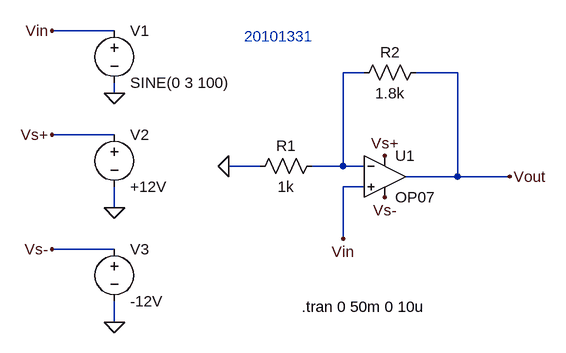
[diagram p0: schematic Non-Inverting Amplifier.asc]
Non-Inverting Amplifier.asc, the LTspice schematic file:
Version 4
SHEET 1 880 680
WIRE 32 -64 -64 -64
WIRE 416 0 384 0
WIRE 560 0 496 0
WIRE 32 32 32 16
WIRE 32 96 -64 96
WIRE 256 144 208 144
WIRE 384 144 384 0
WIRE 384 144 336 144
WIRE 416 144 384 144
WIRE 560 160 560 0
WIRE 560 160 480 160
WIRE 640 160 560 160
WIRE 416 176 384 176
WIRE 32 208 32 176
WIRE 384 256 384 176
WIRE 32 272 -64 272
WIRE 32 384 32 352
FLAG 32 32 0
FLAG 32 208 0
FLAG 32 384 0
FLAG 448 128 Vs+
FLAG 448 192 Vs-
FLAG 208 144 0
FLAG -64 96 Vs+
FLAG -64 272 Vs-
FLAG -64 -64 Vin
FLAG 384 256 Vin
FLAG 640 160 Vout
SYMBOL OpAmps\\OP07 448 96 R0
SYMATTR InstName U1
SYMBOL voltage 32 -80 R0
WINDOW 123 0 0 Left 0
WINDOW 39 0 0 Left 0
SYMATTR InstName V1
SYMATTR Value SINE(0 3 100)
SYMBOL voltage 32 80 R0
WINDOW 123 0 0 Left 0
WINDOW 39 0 0 Left 0
SYMATTR InstName V2
SYMATTR Value +12V
SYMBOL voltage 32 256 R0
WINDOW 123 0 0 Left 0
WINDOW 39 0 0 Left 0
SYMATTR InstName V3
SYMATTR Value -12V
SYMBOL res 352 128 R90
WINDOW 0 0 56 VBottom 2
WINDOW 3 32 56 VTop 2
SYMATTR InstName R1
SYMATTR Value 1k
SYMBOL res 512 -16 R90
WINDOW 0 0 56 VBottom 2
WINDOW 3 32 56 VTop 2
SYMATTR InstName R2
SYMATTR Value 1.8k
TEXT 320 360 Left 2 !.tran 0 50m 0 10u
TEXT 232 -56 Left 2 ;20101331

The netlist it stands for:
* Non-Inverting Amplifier.asc
XU1 Vin N001 Vs+ Vs- Vout LT1001  ; OP07, pins In+ In- V+ V- OUT
V1 Vin 0 SINE(0 3 100)
V2 Vs+ 0 +12V
V3 Vs- 0 -12V
R1 N001 0 1k
R2 Vout N001 1.8k
.tran 0 50m 0 10u
* 20101331
.lib LTC.lib
.backanno
.end